# EAGLE design SchaltplanETP2 (EAGLE 6.3)
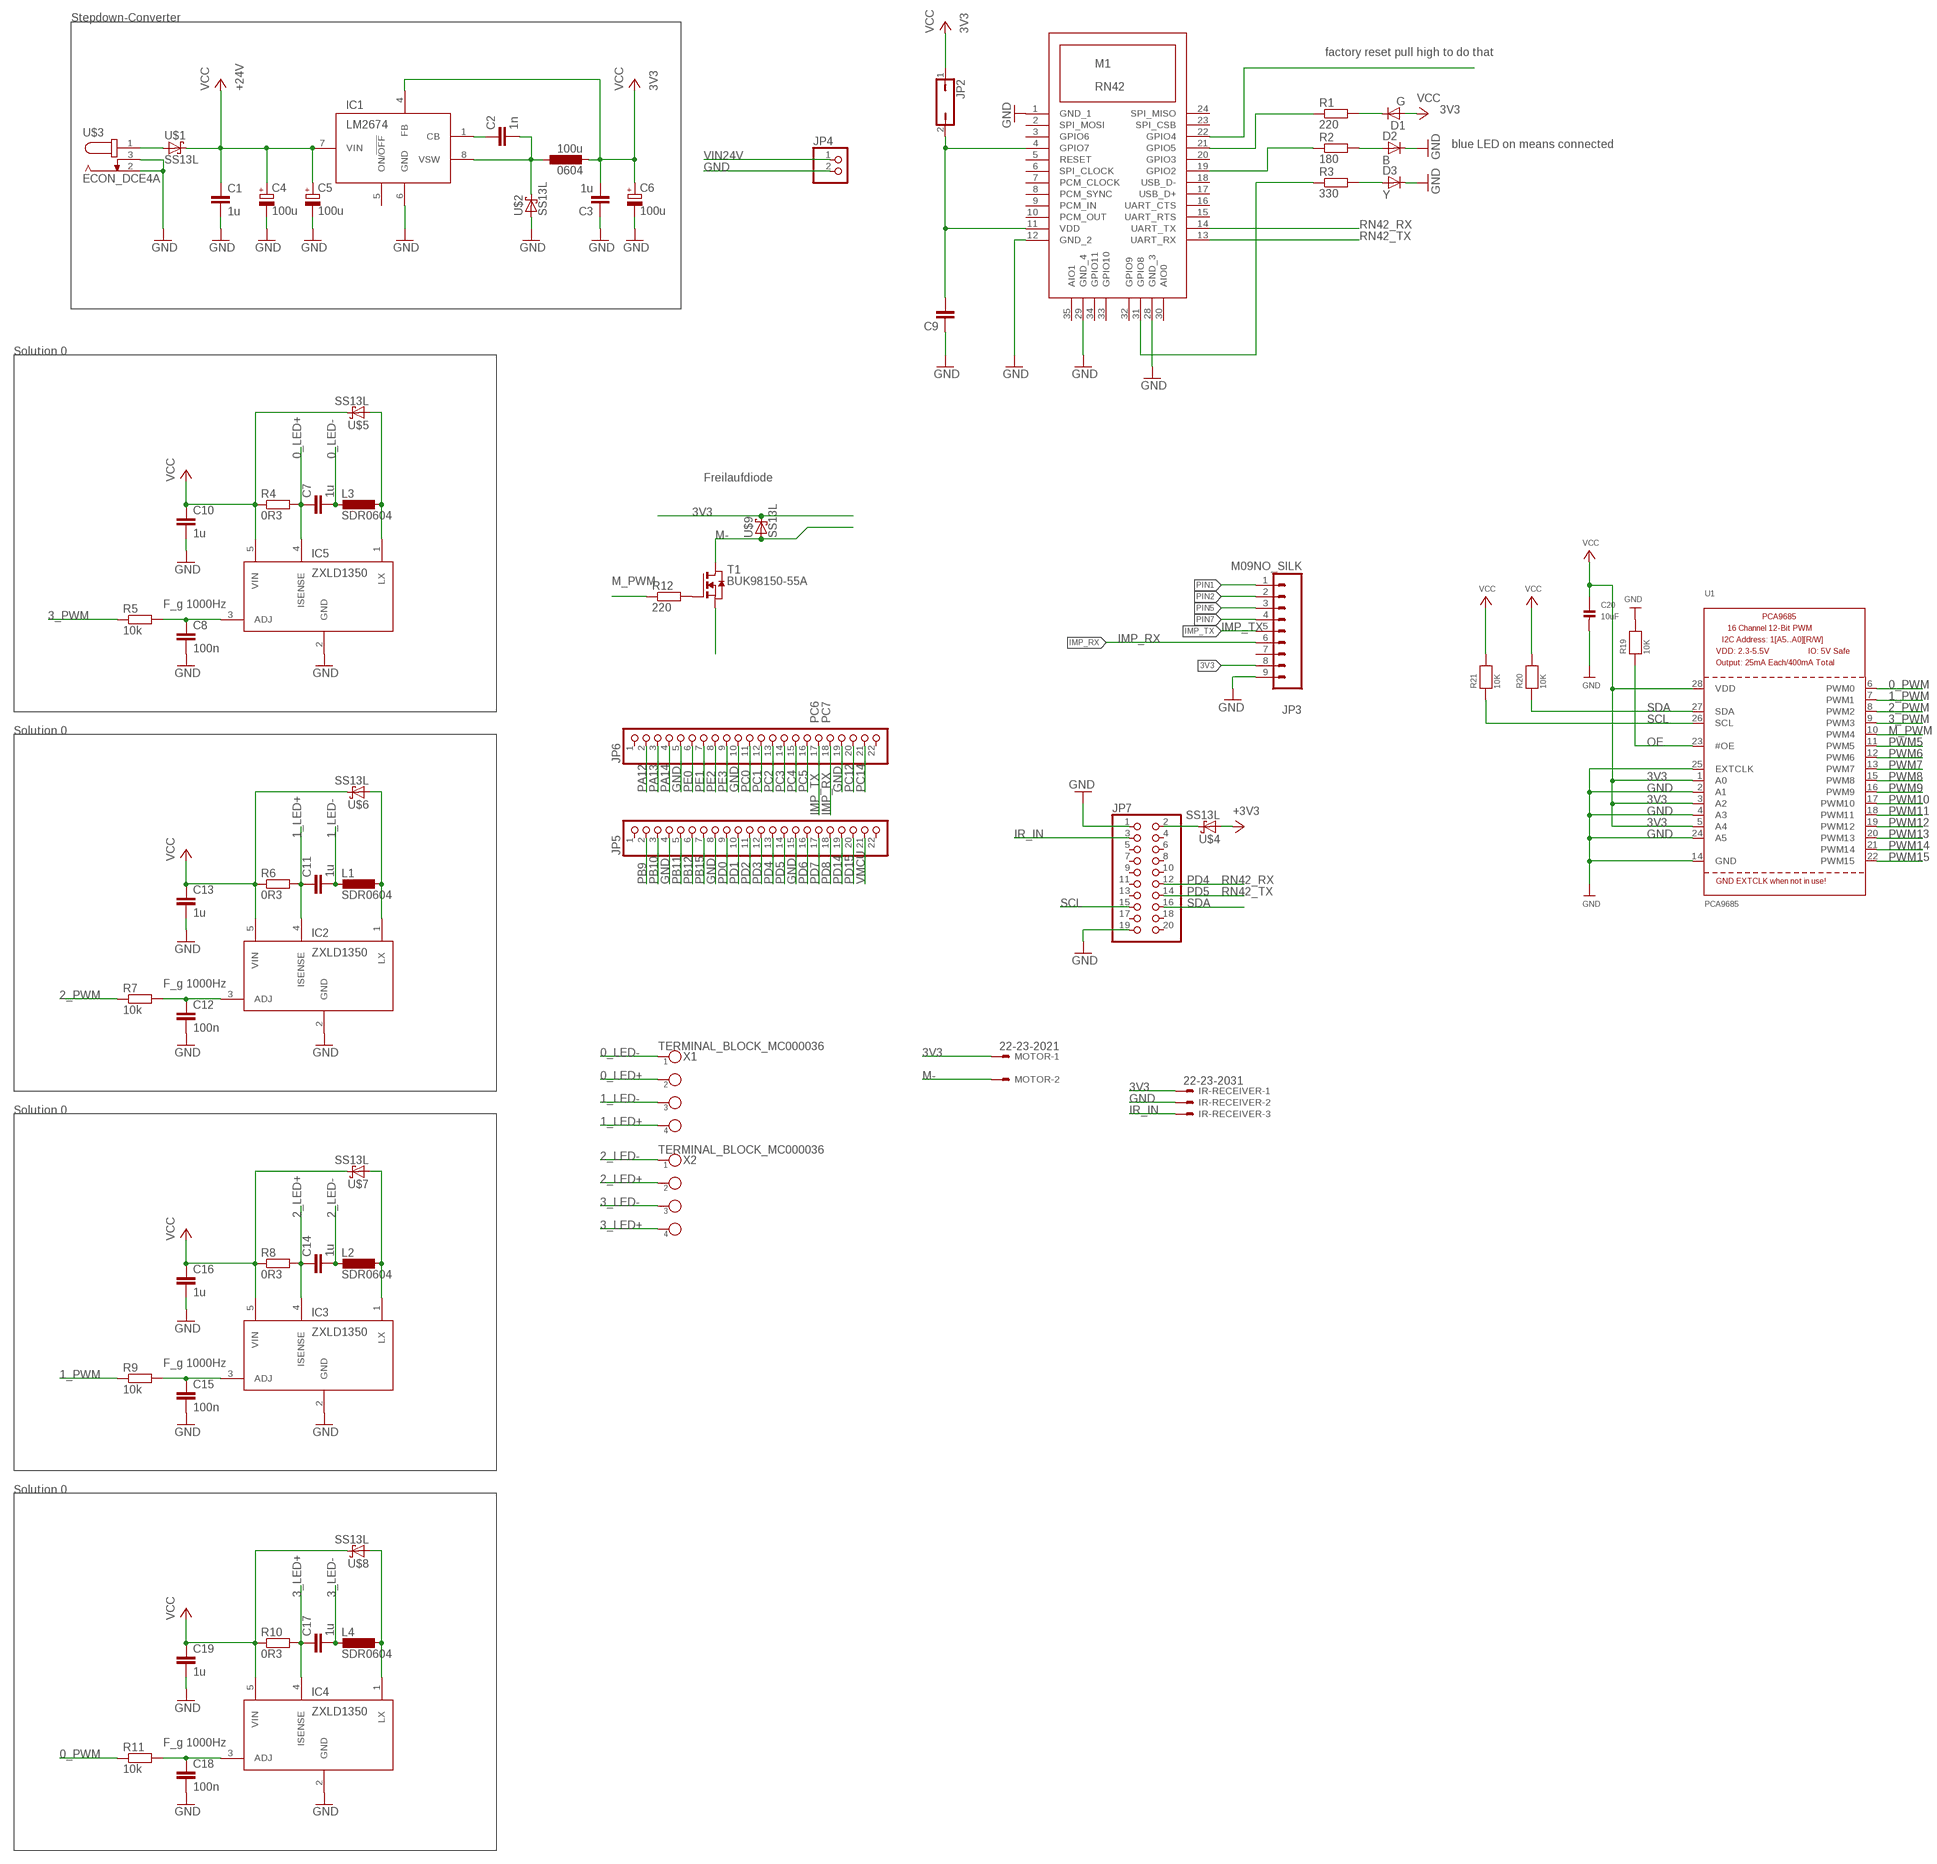
[diagram p0: schematic, sheet 1]

## Parts
0604  100u  SDR0604  [SDR0604]
C1  1u  C-EU050-025X075  [C050-025X075]
C2  1n  C-EUC0805  [C0805]
C3  1u  C-EU050-025X075  [C050-025X075]
C4  100u  CPOL-EUE2.5-7  [E2,5-7]
C5  100u  CPOL-EUE2.5-7  [E2,5-7]
C6  100u  CPOL-EUE2.5-7  [E2,5-7]
C7  1u  C-EU050-024X044  [C050-024X044]
C8  100n  C-EUC0805  [C0805]
C9  C-EUC1808  [C1808]
C10  1u  C-EU050-024X044  [C050-024X044]
C11  1u  C-EU050-024X044  [C050-024X044]
C12  100n  C-EUC0805  [C0805]
C13  1u  C-EU050-024X044  [C050-024X044]
C14  1u  C-EU050-024X044  [C050-024X044]
C15  100n  C-EUC0805  [C0805]
C16  1u  C-EU050-024X044  [C050-024X044]
C17  1u  C-EU050-024X044  [C050-024X044]
C18  100n  C-EUC0805  [C0805]
C19  1u  C-EU050-024X044  [C050-024X044]
C20  10uF  CAP_CERAMIC0805  [0805]
D1  G  TS4148RY  [D0805]
D2  B  TS4148RY  [D0805]
D3  Y  TS4148RY  [D0805]
IC1  LM2674  [SO08]
IC2  ZXLD1350  [TSOT23-5L]
IC3  ZXLD1350  [TSOT23-5L]
IC4  ZXLD1350  [TSOT23-5L]
IC5  ZXLD1350  [TSOT23-5L]
IR-RECEIVER  22-23-2031  [22-23-2031]
JP2  JP1Q  [JP1]
JP3  M09NO_SILK  [1X09_NO_SILK]
JP4  PINHD-1X2  [1X02]
JP5  PINHD-1X22  [1X22]
JP6  PINHD-1X22  [1X22]
JP7  PINHD-2X10  [2X10]
L1  SDR0604  [SDR0604]
L2  SDR0604  [SDR0604]
L3  SDR0604  [SDR0604]
L4  SDR0604  [SDR0604]
M1  RN42_BLUETOOTH  [RN42_BLUETOOTH]
MOTOR  22-23-2021  [22-23-2021]
R1  220  R-EU_R0603  [R0603]
R2  180  R-EU_R0603  [R0603]
R3  330  R-EU_R0603  [R0603]
R4  0R3  R-EU_M0805  [M0805]
R5  10k  R-EU_M0805  [M0805]
R6  0R3  R-EU_M0805  [M0805]
R7  10k  R-EU_M0805  [M0805]
R8  0R3  R-EU_M0805  [M0805]
R9  10k  R-EU_M0805  [M0805]
R10  0R3  R-EU_M0805  [M0805]
R11  10k  R-EU_M0805  [M0805]
R12  220  R-EU_M0805  [M0805]
R19  10K  RESISTOR0805  [0805]
R20  10K  RESISTOR0805  [0805]
R21  10K  RESISTOR0805  [0805]
T1  BUK98150-55A  [SOT223]
U1  PCA9685  [TSSOP28]
U$1  SS13L  [SUB-SMA]
U$2  SS13L  [SUB-SMA]
U$3  ECON_DCE4A  DC_JACK_ECON_DCE4A  [DC_JACK_ECON_DCE4A]
U$4  SS13L  [SUB-SMA]
U$5  SS13L  [SUB-SMA]
U$6  SS13L  [SUB-SMA]
U$7  SS13L  [SUB-SMA]
U$8  SS13L  [SUB-SMA]
U$9  SS13L  [SUB-SMA]
X1  TERMINAL_BLOCK_MC000036  [TERMINAL_BLOCK_MC000036]
X2  TERMINAL_BLOCK_MC000036  [TERMINAL_BLOCK_MC000036]

## Nets
0_LED+: C7.1 IC5.4(ISENSE) R4.2 X1.2
0_LED-: C7.2 L3.2 X1.1
0_PWM: R11.1 U1.6(PWM0)
1_LED+: C11.1 IC2.4(ISENSE) R6.2 X1.4
1_LED-: C11.2 L1.2 X1.3
1_PWM: R9.1 U1.7(PWM1)
2_LED+: C14.1 IC3.4(ISENSE) R8.2 X2.2
2_LED-: C14.2 L2.2 X2.1
2_PWM: R7.1 U1.8(PWM2)
3_LED+: C17.1 IC4.4(ISENSE) R10.2 X2.4
3_LED-: C17.2 L4.2 X2.3
3_PWM: R5.1 U1.9(PWM3)
3V3: 0604.2 C3.2 C6.+ C20.1 D1.A IC1.4(FB) IR-RECEIVER.1 JP2.1 JP3.8 MOTOR.1 R20.2 R21.2 U1.1(A0) U1.3(A2) U1.5(A4) U1.28(VDD) U$4.A U$9.C ; supply symbol labelled VCC, +3V3
+24V: C1.1 C4.+ C5.+ C10.1 C13.1 C16.1 C19.1 IC1.7(VIN) IC2.5(VIN) IC3.5(VIN) IC4.5(VIN) IC5.5(VIN) R4.1 R6.1 R8.1 R10.1 U$1.C U$5.C U$6.C U$7.C U$8.C ; supply symbol labelled VCC
GND: C1.2 C3.1 C4.- C5.- C6.- C8.2 C9.1 C10.2 C12.2 C13.2 C15.2 C16.2 C18.2 C19.2 C20.2 D2.C D3.C IC1.6(GND) IC2.2(GND) IC3.2(GND) IC4.2(GND) IC5.2(GND) IR-RECEIVER.2 JP3.9 JP4.2 JP5.4 JP5.8 JP7.1 JP7.19 M1.1(GND_1) M1.12(GND_2) M1.28(GND_3) M1.29(GND_4) R19.2 U1.2(A1) U1.4(A3) U1.14(GND) U1.24(A5) U1.25(EXTCLK) U$2.A U$3.2 U$3.3
IMP_RX: JP3.6 JP6.18
IMP_TX: JP3.5 JP6.17
IR_IN: IR-RECEIVER.3 JP7.3
M-: MOTOR.2 T1.2(D) T1.4(D) U$9.A
M_PWM: R12.1 U1.10(PWM4)
N$1: R12.2 T1.1(G)
N$2: C2.1 IC1.1(CB)
N$3: 0604.1 C2.2 IC1.8(VSW) U$2.C
N$4: JP7.2 U$4.C
N$5: C9.2 JP2.2 M1.4(GPIO7) M1.11(VDD)
N$6: IC5.1(LX) L3.1 U$5.A
N$7: D1.C R1.2
N$8: D2.A R2.2
N$9: D3.A R3.2
N$10: M1.21(GPIO5) R1.1
N$11: M1.19(GPIO2) R2.1
N$12: M1.31(GPIO8) R3.1
N$13: C8.1 IC5.3(ADJ) R5.2
N$14: IC2.1(LX) L1.1 U$6.A
N$15: C12.1 IC2.3(ADJ) R7.2
N$16: IC3.1(LX) L2.1 U$7.A
N$17: C15.1 IC3.3(ADJ) R9.2
N$18: IC4.1(LX) L4.1 U$8.A
N$19: C18.1 IC4.3(ADJ) R11.2
N$20: T1.3(S)
N$21: M1.22(GPIO4)
OE: R19.1 U1.23(#OE)
PA12: JP6.2
PA13: JP6.3
PB9: JP5.2
PB10: JP5.3
PB11: JP5.5
PB12: JP5.6
PB15: JP5.7
PIN1: JP3.1
PIN2: JP3.2
PIN5: JP3.3
PIN7: JP3.4
PWM5: U1.11(PWM5)
PWM6: U1.12(PWM6)
PWM7: U1.13(PWM7)
PWM8: U1.15(PWM8)
PWM9: U1.16(PWM9)
PWM10: U1.17(PWM10)
PWM11: U1.18(PWM11)
PWM12: U1.19(PWM12)
PWM13: U1.20(PWM13)
PWM14: U1.21(PWM14)
PWM15: U1.22(PWM15)
RN42_RX: JP7.12 M1.14(UART_TX)
RN42_TX: JP7.14 M1.13(UART_RX)
SCL: JP7.15 R21.1 U1.26(SCL)
SDA: JP7.16 R20.1 U1.27(SDA)
VIN24V: JP4.1 U$1.A U$3.1
Unconnected: IC1.5(ON/!OFF) JP3.7 JP5.1 JP5.9 JP5.10 JP5.11 JP5.12 JP5.13 JP5.14 JP5.15 JP5.16 JP5.17 JP5.18 JP5.19 JP5.20 JP5.21 JP5.22 JP6.1 JP6.4 JP6.5 JP6.6 JP6.7 JP6.8 JP6.9 JP6.10 JP6.11 JP6.12 JP6.13 JP6.14 JP6.15 JP6.16 JP6.19 JP6.20 JP6.21 JP6.22 JP7.4 JP7.5 JP7.6 JP7.7 JP7.8 JP7.9 JP7.10 JP7.11 JP7.13 JP7.17 JP7.18 JP7.20 M1.2(SPI_MOSI) M1.3(GPIO6) M1.5(RESET) M1.6(SPI_CLOCK) M1.7(PCM_CLOCK) M1.8(PCM_SYNC) M1.9(PCM_IN) M1.10(PCM_OUT) M1.15(UART_RTS) M1.16(UART_CTS) M1.17(USB_D+) M1.18(USB_D-) M1.20(GPIO3) M1.23(SPI_CSB) M1.24(SPI_MISO) M1.30(AIO0) M1.32(GPIO9) M1.33(GPIO10) M1.34(GPIO11) M1.35(AIO1)

## Notes on the sheet
- Stepdown-Converter
- factory reset pull high to do that
- blue LED on means connected
- Solution 0
- Freilaufdiode
- F_g 1000Hz
- PC6 | PC7
- Solution 0
- PD4
- PD5
- F_g 1000Hz
- Solution 0
- F_g 1000Hz
- Solution 0
- F_g 1000Hz

## Library data of the parts
0604 L1-L4 = Moodlight:SDR0604: SDR0604
C1-C3 C7-C19 = rcl:C-EU: CAPACITOR, European symbol
C4-C6 = rcl:CPOL-EU: POLARIZED CAPACITOR, European symbol
C20 = microbuilder:CAP_CERAMIC: Ceramic Capacitors 0402 - 0402 Surface Mount Capacitors 16pF 50V 5% [Digikey: 445-4899-2-ND] 18pF 50V 5% [Digikey: 490-1281-2-ND] 22pF 50V 5% [Digikey: 490-1283-2-ND] 68pF 50V 5% [Digikey: 490-1289-2-ND] 0.1uF 10V 10% [Digikey: 490-1318-2-ND] 1.0uF 6.3V 10% [Digikey: 490-1320-2-ND] 0603 - 0603 Surface Mount Capacitors 16 pF 50V 5% [Digikey: 445-5051-2-ND] 22 pF 50V [Digikey: PCC220ACVTR-ND] 33 pF 50V 5% [Digikey: 490-1415-1-ND] 56pF 50V 5% [Digikey: 490-1421-1-ND] 220pF 50V 5% [Digikey: 445-1285-1-ND] 680 pF 50V 2200 pF 50V 5% C0G [Digikey: 445-1297-1-ND] 5600 pF 100V 5% X7R [Digikey: 478-3711-1-ND] 0.1 µF 25V 10% [Digikey: PCC2277TR-ND] 0.22 µF 16V 10% X7R [Digikey: 445-1318-1-ND] 1.0 µF 25V 10% [Digikey: 445-5146-2-ND] 0603 - RF Specific 3pF 250V +/-0.1pF RF [Digikey: 712-1347-1-ND] 18 pF 250V 5% [Digikey: 478-3505-1-ND or 712-1322-1-ND] 56 pF 250V 5% C0G RF [Digikey: 490-4867-1-ND] 68 pF 250V RF [Digikey: 490-4868-1-ND] 0805 - 0805 Surface Mount Capacitors 220 pF 250V 2% RF Ceramic Capacitor [Digikey: 712-1398-1-ND] 1000 pF 50V 2% NP0 Ceramic Capacitor [Digikey: 478-3760-1-ND] 0.1 µF 25V 10% Ceramic Capacitor [Digikey: PCC1828TR-ND] 1.0 µF 16V 10% Ceramic Capacitor[Digikey: 490-1691-2-ND] 10.0 µF 10V 10% Ceramic Capacitor[Digikey: 709-1228-1-ND] 10.0 uF 16V 10% Ceramic Capacitor [Digikey: 478-5165-2-ND] 47 uF 6.3V 20% Ceramic Capacitor [Digikey: 587-1779-1-ND or 399-5506-1-ND] 1206 - 1206 Surface Mount Capacitors 47uF 10V 20% Ceramic Capacitor [Digikey: 490-5528-1-ND or 399-5508-1-ND or 445-6010-1-ND] 100uF 6.3V -20%, +80% Y5V Ceramic Capacitor (Digikey: 490-4512-1-ND, Mouser: 81-GRM31CF50J107ZE1L)
D1-D3 = Moodlight:TS4148RY: Small Signal Diode
IC1 = Moodlight:LM2674: LM2674 High Efficiency 500 mA Step-Down Voltage Regulator
IC2-IC5 = Moodlight:ZXLD1350: ZXLD1350 30V 350mA LED DRIVER with AEC-Q100
IR-RECEIVER = con-molex:22-23-2031: .100" (2.54mm) Center Header - 3 Pin; MF: MOLEX; MPN: 22-23-2031; OC_FARNELL: 1462950; OC_NEWARK: 30C0862
JP2 = jumper:JP1Q: JUMPER
JP3 = SparkFun-Connectors:M09: Header 9 Standard 9-pin 0.1" header. Use with straight break away headers (SKU : PRT-00116), right angle break away headers (PRT-00553), swiss pins (PRT-00743), machine pins (PRT-00117), and female headers (PRT-00115).
JP4 = pinhead:PINHD-1X2: PIN HEADER
JP5 JP6 = pinhead:PINHD-1X22: PIN HEADER
JP7 = pinhead:PINHD-2X10: PIN HEADER
M1 = Moodlight:RN42_BLUETOOTH: RN42 Bluetooth module
MOTOR = con-molex:22-23-2021: .100" (2.54mm) Center Header - 2 Pin; MF: MOLEX; MPN: 22-23-2021; OC_FARNELL: 1462926; OC_NEWARK: 25C3832
R1-R12 = rcl:R-EU_: RESISTOR, European symbol
R19-R21 = microbuilder:RESISTOR: Resistors 0402 - 0402 Surface Mount Package 22 Ohm 1% 1/16W [Digikey: 311-22.0LRTR-ND] 33 Ohm 5% 1/16W 1.0K 5% 1/16W 1.5K 5% 1/16W 2.0K 1% 1/16W 10.0K 1% 1/16W [Digikey: 311-10.0KLRTR-ND] 10.0K 5% 1/16W [Digikey: RMCF0402JT10K0TR-ND] 12.1K 1% 1/16W [Digikey: 311-22.0LRTR-ND] 100.0K 5% 1/16W 0603 - 0603 Surface Mount Package 0 Ohm 1/10 Watt 1% Resistor 15 Ohm 1/10 Watt 1% Resistor 33 Ohm 1/10 Watt 1% Resistor 49.9 Ohm 1/10 Watt 1% Resistor 100 Ohm 1/10 Watt 1% Resistor 150 Ohm 1/10 Watt 1% Resistor 240 Ohm 1/10 Watt 1% Resistor 390 Ohm 1/10 Watt 1% Resistor 560 Ohm 1/10 Watt 1% Resistor 680 Ohm 1/10 Watt 1% Resistor 750 Ohm 1/10 Watt 1% Resistor 1.0K Ohm 1/10 Watt 1% Resistor 1.5K Ohm 1/10 Watt 1% Resistor 2.0K Ohm 1/10 Watt 1% Resistor 2.2K Ohm 1/10 Watt 1% Resistor 3.3K Ohm 1/10 Watt 1% Resistor 4.7K Ohm 1/10 Watt 1% Resistor 10.0K Ohm 1/10 Watt 1% Resistor 12.0K Ohm 1/10 Watt 1% Resistor 12.1K Ohm 1/10 Watt 1% Resistor 20.0K Ohm 1/10 Watt 1% Resistor 33.0K Ohm 1/10 Watt 1% Resistor 100.0K Ohm 1/10 Watt 1% Resistor 0805 - 0805 Surface Mount Package 0 Ohm 1/8 Watt 1% Resistor 33 Ohm 1/8 Watt 1% Resistor 100 Ohm 1/8 Watt 1% Resistor 150 Ohm 1/8 Watt 1% Resistor 200 Ohm 1/8 Watt 1% Resistor 240 Ohm 1/8 Watt 1% Resistor 330 Ohm 1/8 Watt 1% Resistor 390 Ohm 1/8 Watt 1% Resistor 470 Ohm 1/8 Watt 1% Resistor 1.0K Ohm 1/8 Watt 1% Resistor 1.5K Ohm 1/8 Watt 1% Resistor 2.0K Ohm 1/8 Watt 1% Resistor 4.7K Ohm 1/8 Watt 1% Resistor 5.1K Ohm 1/8 Watt 1% Resistor 5.6K Ohm 1/8 Watt 1% Resistor 10.0K Ohm 1/8 Watt 1% Resistor 22.0K Ohm 1/8 Watt 1% Resistor 33.0K Ohm 1/8 Watt 1% Resistor 100K Ohm 1/8 Watt 1% Resistor 1206 - 1206 Surface Mount Package 2012 - 2010 Surface Mount Package 0.11 Ohm 1/2 Watt 1% Resistor - Digikey: RHM.11UCT-ND
T1 = Moodlight:BUK98150-55A: n-Kanal-MOS-FET; OC_FARNELL: unknown; OC_NEWARK: unknown
U1 = microbuilder:PCA9685: PCA9685 - 16 Channel 12-Bit I2C PWM Controller 5.0V tolerant 16 channel, 12-bit I2C PWM controller with 25mA per output (max. 400mA total) Digikey: 568-5931-1-ND
U$1 U$2 U$4-U$9 = Moodlight:SS13L: Schottky-Diode 1A/30V
U$3 = Moodlight:DC_JACK_ECON_DCE4A: DC_JACK_ECON_DCE4A
X1 X2 = Moodlight:TERMINAL_BLOCK_MC000036: Terminal Block MC000036

## Board
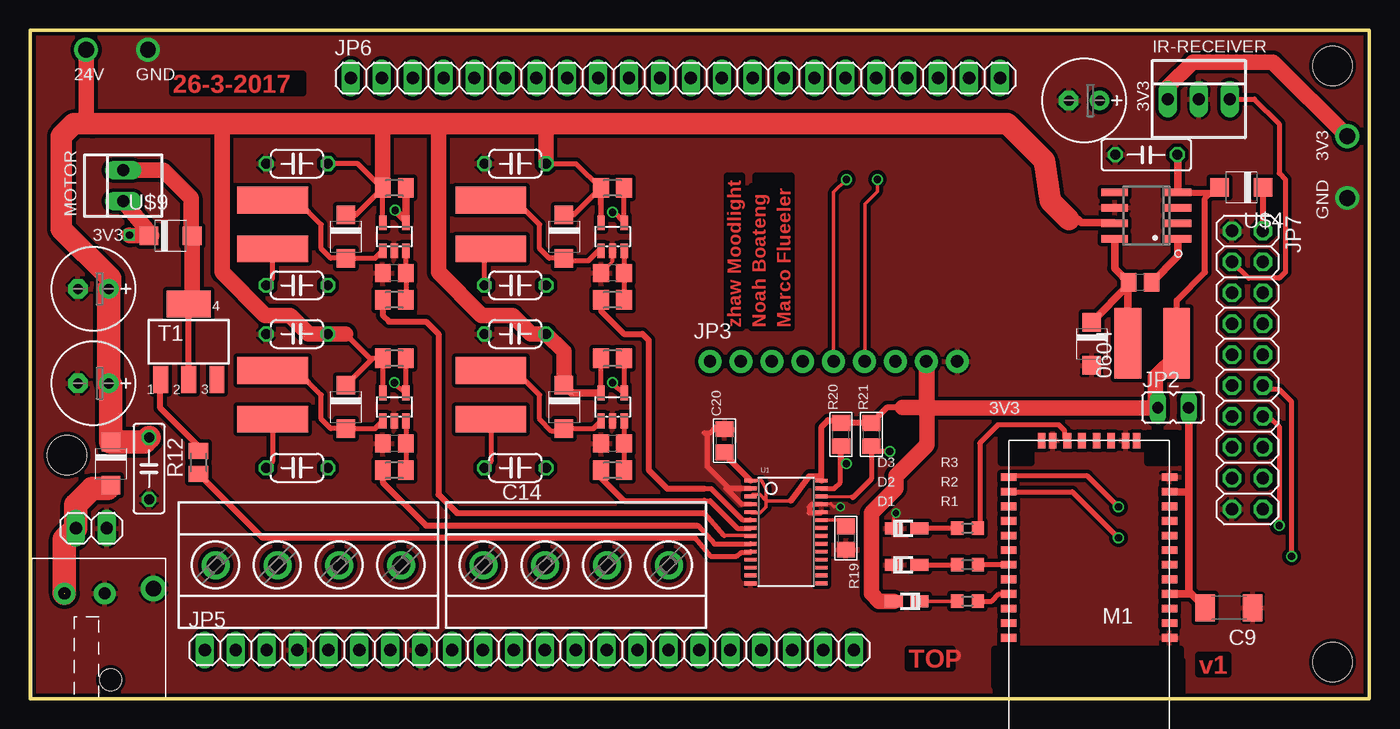
[diagram p1: board, top side]
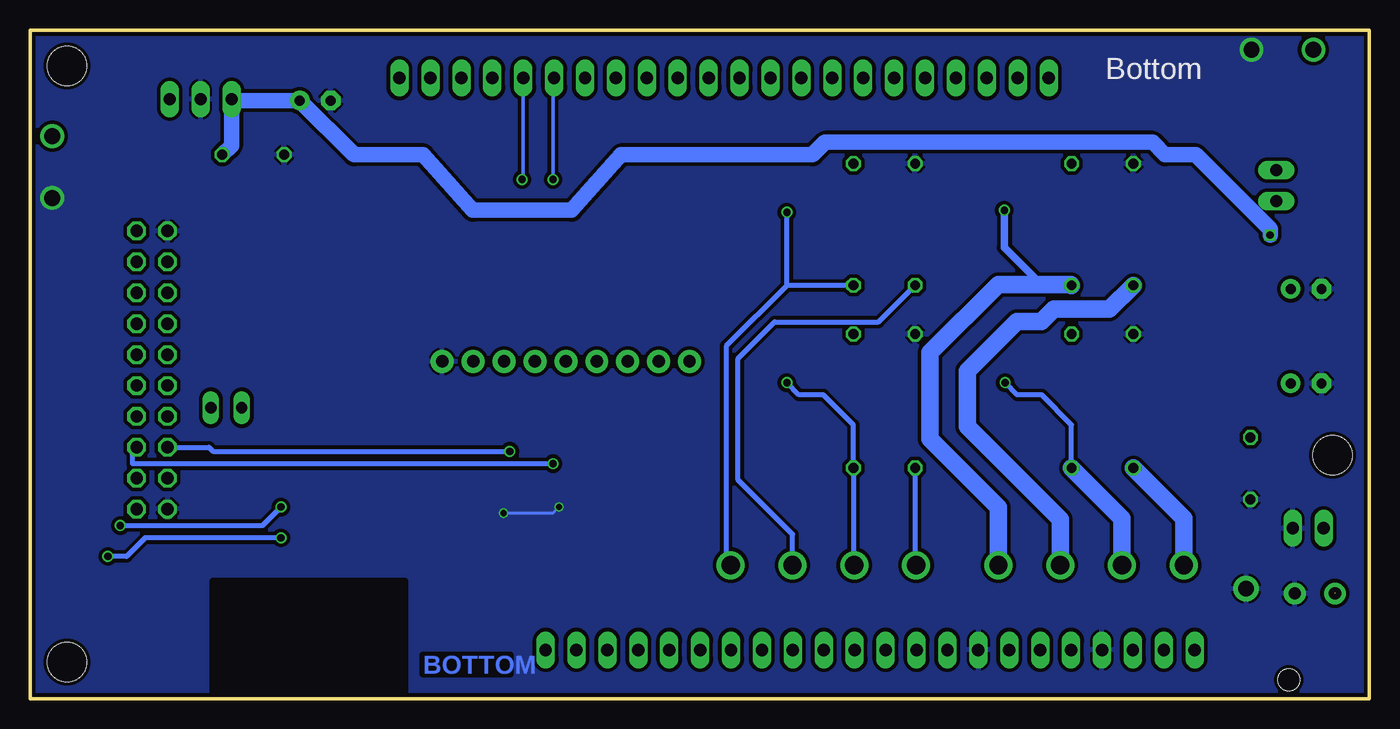
[diagram p2: board, bottom side, seen from below]

Size 110 x 54.92 mm. Coordinates in mm from the lower left corner, seen from the top.
Outline: 0,0 110,0 110,54.92 0,54.92 0,0
Copper layers (1*16): Top 0.018mm / dielectric 1.55mm / Bottom 0.018mm
Design rules "eC_2Layer_PClass6_BaseCopperO18_eCDefault": minimum track width 0.15mm, minimum drill 0.35mm, track to track 0.15mm, track to pad 0.15mm, pad to pad 0.15mm, via to via 0.15mm, smd to smd 0mil, copper to edge 0.25mm, drill to drill 0.35mm, minimum pad ring 0.175mm, minimum via ring 0.125mm, stop-mask expansion 0mil, vias tented up to drill 0.45mm, thermal gap 0.2mm
Holes 3.2 mm at 3,20 107,3 107,52
tRestrict: area 79.2,1 to 94.5,4.1
bRestrict: area 79.2,-0.5 to 95,9.7

### Footprints (pad centres in the part's own frame; a part is rotated, then mirrored left to right if it is on the bottom)
SDR0604 = smd 5.8 x 2.2: 1 0,2; 2 0,-2
C050-025X075 = drill 0.813 octagon: 1 -2.54,0; 2 2.54,0
C0805 = smd 1.3 x 1.5: 1 -0.95,0; 2 0.95,0
E2,5-7 = drill 0.813 pad 1.6: + -1.27,0 | drill 0.813 pad 1.6 octagon: - 1.27,0
C050-024X044 = drill 0.813 octagon: 1 -2.54,0; 2 2.54,0
C1808 = smd 1.6 x 2.2: 1 -1.95,0; 2 1.95,0
0805 = smd 1.3 x 1.5: 1 -0.95,0; 2 0.95,0
D0805 = smd 1.5 x 1: A 1.052,0; C -1.052,0
SO08 = smd 0.6 x 2.2: 1 -1.905,-2.6; 2 -0.635,-2.6; 3 0.635,-2.6; 4 1.905,-2.6; 5 1.905,2.6; 6 0.635,2.6; 7 -0.635,2.6; 8 -1.905,2.6
TSOT23-5L = smd 0.6 x 1.2: 1 -0.95,-1.15; 2 0,-1.15; 3 0.95,-1.15; 4 0.95,1.15; 5 -0.95,1.15
22-23-2031 = drill 1 long: 1 -2.54,0; 2 0,0; 3 2.54,0
JP1 = drill 0.914 long: 1 0,-1.27; 2 0,1.27
1X09_NO_SILK = drill 1.016 pad 1.88: 1 0,0; 2 2.54,0; 3 5.08,0; 4 7.62,0; 5 10.16,0; 6 12.7,0; 7 15.24,0; 8 17.78,0; 9 20.32,0
1X02 = drill 1.016 long: 1 -1.27,0; 2 1.27,0
1X22 = drill 1.016 long: 1 -26.67,0; 2 -24.13,0; 3 -21.59,0; 4 -19.05,0; 5 -16.51,0; 6 -13.97,0; 7 -11.43,0; 8 -8.89,0; 9 -6.35,0; 10 -3.81,0; 11 -1.27,0; 12 1.27,0; 13 3.81,0; 14 6.35,0; 15 8.89,0; 16 11.43,0; 17 13.97,0; 18 16.51,0; 19 19.05,0; 20 21.59,0; 21 24.13,0; 22 26.67,0
2X10 = drill 1.016 octagon: 1 -11.43,-1.27; 2 -11.43,1.27; 3 -8.89,-1.27; 4 -8.89,1.27; 5 -6.35,-1.27; 6 -6.35,1.27; 7 -3.81,-1.27; 8 -3.81,1.27; 9 -1.27,-1.27; 10 -1.27,1.27; 11 1.27,-1.27; 12 1.27,1.27; 13 3.81,-1.27; 14 3.81,1.27; 15 6.35,-1.27; 16 6.35,1.27; 17 8.89,-1.27; 18 8.89,1.27; 19 11.43,-1.27; 20 11.43,1.27
RN42_BLUETOOTH = smd 1.27 x 0.635: 1 -6.6,0; 2 -6.6,-1.2; 3 -6.6,-2.4; 4 -6.6,-3.6; 5 -6.6,-4.8; 6 -6.6,-6; 7 -6.6,-7.2; 8 -6.6,-8.4; 9 -6.6,-9.6; 10 -6.6,-10.8; 11 -6.6,-12; 12 -6.6,-13.2; 13 6.6,-13.2; 14 6.6,-12; 15 6.6,-10.8; 16 6.6,-9.6; 17 6.6,-8.4; 18 6.6,-7.2; 19 6.6,-6; 20 6.6,-4.8; 21 6.6,-3.6; 22 6.6,-2.4; 23 6.6,-1.2; 24 6.6,0 | smd 0.635 x 1.27: 28 3,-16.2; 29 -3,-16.2; 30 3.9,-16.2; 31 1.8,-16.2; 32 0.6,-16.2; 33 -0.6,-16.2; 34 -1.8,-16.2; 35 -3.9,-16.2
22-23-2021 = drill 1 long: 1 -1.27,0; 2 1.27,0
R0603 = smd 1 x 1.1: 1 -0.85,0; 2 0.85,0
M0805 = smd 1.3 x 1.6: 1 -0.95,0; 2 0.95,0
SOT223 = smd 1.219 x 2.235: 1 -2.311,-3.099; 2 0,-3.099; 3 2.311,-3.099 | smd 3.6 x 2.2: 4 0,3.099
TSSOP28 = smd 0.305 x 0.991: 1 -4.225,-2.918; 2 -3.575,-2.918; 3 -2.925,-2.918; 4 -2.275,-2.918; 5 -1.625,-2.918; 6 -0.975,-2.918; 7 -0.325,-2.918; 8 0.325,-2.918; 9 0.975,-2.918; 10 1.625,-2.918; 11 2.275,-2.918; 12 2.925,-2.918; 13 3.575,-2.918; 14 4.225,-2.918; 15 4.225,2.918; 16 3.575,2.918; 17 2.925,2.918; 18 2.275,2.918; 19 1.625,2.918; 20 0.975,2.918; 21 0.325,2.918; 22 -0.325,2.918; 23 -0.975,2.918; 24 -1.625,2.918; 25 -2.275,2.918; 26 -2.925,2.918; 27 -3.575,2.918; 28 -4.225,2.918
SUB-SMA = smd 1.524 x 1.524: A 1.778,0; C -1.778,0
DC_JACK_ECON_DCE4A = drill 1 pad 1.778: 1 0,3.8; 3 0,0.5 | drill 1.3 pad 2.1: 2 0.4,-3.5 | hole 1.8: -7.1,0
TERMINAL_BLOCK_MC000036 = drill 1.501 pad 2.3: 1 -7.62,0; 2 -2.54,0; 3 2.54,0; 4 7.62,0

### Placement (x,y rotation side)
0604  92.18,29.21 90 top
C1  9.74,18.91 270 top
C2  91.18,34.21 180 top
C3  91.69,44.7 0 top
C4  5.18,25.91 180 top
C5  5.18,33.68 180 top
C6  86.6,49.16 180 top
C7  21.9,18.97 180 top
C8  29.9,20.97 180 top
C9  98.49,7.46 180 top
C10  21.9,29.97 180 top
C11  21.9,33.97 180 top
C12  29.9,34.97 180 top
C13  21.9,43.97 180 top
C14  39.84,18.97 180 top
C15  47.84,20.97 180 top
C16  39.84,29.97 180 top
C17  39.84,33.97 180 top
C18  47.84,34.97 180 top
C19  39.84,43.97 180 top
C20  57.03,21.19 90 top
D1  72,8 180 top
D2  72,11 0 top
D3  72,14 0 top
IC1  91.69,39.7 90 top
IC2  29.9,37.97 0 top
IC3  47.84,23.97 0 top
IC4  47.84,37.97 0 top
IC5  29.9,23.97 0 top
IR-RECEIVER  96.01,49.28 0 top
JP2  93.9,23.9 270 top
JP3  55.84,27.71 0 top
JP4  5,14 0 top
JP5  41,4 0 top
JP6  53,51 0 top
JP7  100,27 270 top
L1  19.9,38.97 0 top
L2  37.84,24.97 0 top
L3  19.9,24.97 0 top
L4  37.84,38.97 0 top
M1  87,5 180 top
MOTOR  7.62,42.16 90 top
R1  77,8 180 top
R2  77,11 180 top
R3  77,14 180 top
R4  29.9,27.97 0 top
R5  29.9,18.77 0 top
R6  29.9,41.97 0 top
R7  29.9,32.77 0 top
R8  47.84,27.97 0 top
R9  47.84,18.77 0 top
R10  47.84,41.97 0 top
R11  47.84,32.77 0 top
R12  13.82,19.42 90 top
R19  67.02,13.19 270 top
R20  66.62,21.7 90 top
R21  69.11,21.7 90 top
T1  13.01,29.32 0 top
U1  62.09,13.7 270 top
U$1  6.6,19.3 270 top
U$2  87.2,29.16 270 top
U$3  6.6,8.64 90 top
U$4  99.51,42 180 top
U$5  25.9,23.97 270 top
U$6  25.9,37.97 270 top
U$7  43.84,23.97 270 top
U$8  43.84,37.97 270 top
U$9  11.52,38.05 0 top
X1  22.84,10.97 0 top
X2  44.84,10.97 0 top

### Tracks (layer width: path | path; a pad name or v marks a point on that pad's centre or on a via)
0_LED+  (via drill 0.6)
  Top 0.406: R4.2 IC5.4 29.7,25.97 v29.9,25.97
  Bottom 0.406: C7.1 24.44,22.51 26.9,24.97 28.9,24.97 v29.9,25.97
  Bottom 1.422: X1.2 20.3,14.82 C7.1
0_LED-
  Top 0.406: L3.2 19.9,19.51 C7.2
  Bottom 1.422: X1.1 15.22,14.82 C7.2
0_PWM
  Top 0.406: 55.37,17.27 55.93,17.27 58.5,14.7 59.15,14.7 U1.6
  Top 0.508: R11.1 46.89,31.85 48.77,29.97 50.29,29.97 50.8,29.46 50.8,18.8 52.32,17.27 55.37,17.27
1_LED+  (via drill 0.6)
  Top 0.61: R6.2 IC2.4 30.85,39.25 v29.97,40.13
  Bottom 0.61: v29.97,40.13 29.97,37.08 26.92,34.04
  Bottom 1.422: X1.4 30.46,15.73 36.07,21.34 36.07,28.45 30.48,34.04 26.92,34.04 24.51,34.04 C11.1
1_LED-
  Top 0.406: C11.2 19.9,34.51 L1.2
  Bottom 1.422: X1.3 25.38,14.71 33.02,22.35 33.02,26.92 28.96,30.99 26.92,30.99 25.91,32 21.33,32 C11.2
1_PWM
  Top 0.406: 55.37,16.26 55.84,16.26 58.1,14 59.15,14 U1.7
  Top 0.508: R9.1 46.89,18.13 48.77,16.26 55.37,16.26
2_LED+  (via drill 0.6)
  Top 0.406: R8.2 IC3.4 47.64,25.97 v47.84,25.97
  Bottom 0.406: X2.2 42.38,11.05 C14.1 42.38,22.51 44.84,24.97 46.84,24.97 v47.84,25.97
2_LED-
  Top 0.406: L2.2 37.84,19.51 C14.2
  Bottom 0.406: C14.2 37.3,11.05 X2.1
2_PWM
  Top 0.305: 57.01,13.4 59.15,13.4 U1.8
  Top 0.406: 57.01,13.4 55.37,15.24
  Top 0.508: R7.1 28.95,31.5 29.46,30.99 32.51,30.99 33.53,29.97 33.53,16.76 35.05,15.24 55.37,15.24
3_LED+  (via drill 0.6)
  Top 0.406: R10.2 IC4.4 47.94,39.97 v47.84,39.97
  Bottom 0.406: C17.1 47.84,33.97 | 47.84,33.97 52.84,28.97 52.84,11.35 X2.4 | 47.84,33.97 v47.84,39.97
3_LED-
  Top 0.406: C17.2 37.3,36.43 L4.2
  Bottom 0.406: X2.3 47.38,13.51 51.84,17.97 51.84,27.97 48.84,30.97 40.3,30.97 C17.2
3_PWM
  Top 0.406: 54.77,14.22 54.88,14.22 56.2,12.7 59.15,12.7 U1.9
  Top 0.508: R5.1 28.95,17.78 32.51,14.22 54.77,14.22
3V3  (via drill 0.6, 1.3)
  Top 0.305: U1.1 60.09,17.92 60.45,17.27 60.45,16.26 | U1.5 59.26,15.24 59.94,15.24 60.45,15.75 60.45,16.26 | 60.45,16.26 59.94,16.76 59.32,16.76 U1.3 | 60.45,16.26 62.48,16.26
  Top 0.508: IC1.4 97.03,41.6 | 97.03,41.6 97.33,41.6 U$4.A | 0604.2 94.18,32.72 96.52,35.05 96.52,41.1 97.03,41.6 | 57.03,20.07 U1.1 | 71.67,23.92 70.38,23.92 R21.2 R20.2 66.4,22.86 65.53,22.86 65.01,22.34 U1.28 64.87,18.29 64.01,18.29 62.48,16.26
  Top 0.61: IC1.4 94.29,44.64 C3.2 | C20.1 57.03,20.07
  Top 1.27: MOTOR.1 9.95,38.05 U$9.C 8.18,38.05 v8.13,38.1 | 0604.2 94.18,28.14 92.46,26.42 92.46,24.08 JP2.1 92.6,23.88 73.66,23.88 | D1.A 69.72,8 69.09,8.64 69.09,15.24 71.12,17.27 71.12,18.29 73.66,20.83 73.66,23.88 | 73.66,23.88 73.66,27.67 JP3.8 73.62,23.92 | 73.62,23.92 73.66,23.88 | 73.62,23.92 71.67,23.92 | v108.2,46.23 102.11,52.32 95.5,52.32 93.47,50.29 IR-RECEIVER.1
  Bottom 1.27: v8.13,38.1 8.13,38.61 14.22,44.7 16.76,44.7 17.78,45.72 44.7,45.72 45.72,44.7 61.47,44.7 65.53,40.13 73.66,40.13 77.72,44.7 83.41,44.7 C6.+ 92.85,49.16 IR-RECEIVER.1 93.47,45.46 C3.2
+24V  (via drill 1.3)
  Top 0.406: 28.13,27.97 R4.1 IC5.5 | 28.13,27.97 U$5.C | 28.95,41.92 R6.1 26.73,39.75 U$6.C | IC2.5 28.95,41.92 | 28.95,41.92 26.9,43.97 C13.1 | IC3.5 R8.1 | 28.13,27.97 27.9,27.97 25.9,29.97 C10.1 | C19.1 44.84,43.97 R10.1 IC4.5 46.85,41.97 | 46.85,41.97 46.84,41.97 | U$8.C 44.63,39.75 46.85,41.97
  Top 0.61: 85.34,39.37 86.11,39.37 86.36,39.12 89.04,39.12 IC1.7 | IC3.5 44.47,25.12 U$7.C
  Top 1.27: C19.1 42.38,46.95 42.67,47.24 | 28.95,41.92 28.95,47.24 28.96,47.24 | 25.9,29.97 22.86,29.97 21.34,31.5 19.3,31.5 15.75,35.05 15.75,47.24 | U$7.C 43.84,28.51 C16.1 41.15,29.97 39.62,31.5 37.08,31.5 33.53,35.05 33.53,47.24 | v4.57,53.34 4.57,47.75 5.08,47.24
  Top 1.778: C5.+ 6.6,33.83 6.6,34.54 2.54,38.61 2.54,46.23 3.56,47.24 5.08,47.24 15.75,47.24 28.96,47.24 33.53,47.24 42.67,47.24 80.26,47.24 83.31,44.2 83.82,40.89 85.34,39.37
  Top 1.93: C5.+ C4.+ 6.6,25.75 U$1.C 9.38,21.08 C1.1
GND  (via drill 0.5, 1.3)
  Top 0.254: D3.C 70.95,15.07 v71.12,15.24 | v66.55,15.75 66.04,15.75 65.79,16 65.04,16 U1.25
  Top 0.305: IC4.2 47.84,35.92 C18.2
  Top 0.406: U1.4 58.42,15.97 58.42,16 57.15,17.27 57.4,17.27 | 57.4,17.27 U1.2 57.41,17.27 57.4,17.27 | 57.4,17.27 55.63,19.05 55.63,21.59 55.37,21.84 55.88,21.84 56.39,22.35 56.9,22.35 | U1.25 64.23,15.97 64.01,15.75 64.01,15.24 64.93,15.24 U1.24
  Bottom 0.254: v71.12,15.24 67.06,15.24 v66.55,15.75
  other vias: 9.65,53.34 108.2,41.15
  pour Bottom (isolate 0.305): 0,54.86 110.24,54.86 110.24,-0.51 0,-0.51
  pour Top (isolate 0.305): 0,54.86 110.24,54.86 110.24,0 0,0
IMP_RX  (via drill 0.6)
  Top 0.305: v69.6,42.67 69.6,41.66 68.58,40.64 68.58,27.75 JP3.6
  Bottom 0.305: JP6.18 69.51,42.76 v69.6,42.67
IMP_TX  (via drill 0.6)
  Top 0.305: JP3.5 66,41.62 v67.06,42.67
  Bottom 0.305: v67.06,42.67 67.06,50.91 JP6.17
IR_IN
  Top 0.406: IR-RECEIVER.3 100.58,49.28 102.62,47.24 102.62,43.18 103.12,42.67 103.12,35.05 102.62,34.54 100.08,34.54 JP7.3
M-
  Top 0.508: T1.2 T1.4
  Top 1.27: MOTOR.2 10.92,43.43 13.21,41.15 13.21,38.14 U$9.A 13.29,32.7 T1.4
M_PWM
  Top 0.406: 54.57,13.21 54.57,13.23 55.9,11.7 58,11.7 58.4,12 59.15,12 U1.10
  Top 0.508: 54.57,13.21 19.08,13.21 R12.1
N$1
  Top 0.508: R12.2 13.82,20.72 10.67,23.88 10.67,26.42 10.38,26.42 T1.1
N$2
  Top 0.61: IC1.1 94.29,36.37 C2.1
N$3
  Top 0.61: IC1.8 89.09,35.35 C2.2 | C2.2 90.23,33.97 U$2.C | 0604.1 90.18,34.16 C2.2
N$4
  Top 0.508: U$4.C 101.29,38.41 | 101.29,38.41 101.6,38.1 | 101.29,38.41 JP7.2
N$5
  Top 0.61: M1.4 95.4,8.6 | 95.4,8.6 C9.2 | JP2.2 95.17,16.76 | 95.17,16.76 95.17,8.83 95.4,8.6 | M1.11 94.93,17 95.17,16.76
N$6
  Top 0.406: IC5.1 28.33,22.19 U$5.A 24.68,22.19 23.9,22.97 23.9,24.97 21.9,26.97 L3.1
N$7
  Top 0.305: R1.2 D1.C
N$8
  Top 0.406: D2.A R2.2
N$9
  Top 0.406: R3.2 D3.A
N$10
  Top 0.406: R1.1 79,8 79.6,8.6 M1.21
N$11
  Top 0.406: M1.19 R2.1
N$12
  Top 0.406: M1.31 85,21.4 85,22 84.51,22.5 79.49,22.5 78,21 78,14 R3.1
N$13
  Top 0.406: R5.2 C8.1 IC5.3
N$14
  Top 0.406: L1.1 21.9,40.97 23.9,38.97 23.9,36.97 24.68,36.19 U$6.A 28.33,36.19 IC2.1
N$15
  Top 0.406: R7.2 C12.1 IC2.3
N$16
  Top 0.406: L2.1 39.84,26.97 41.84,24.97 41.84,22.97 42.84,21.97 43.62,21.97 U$7.A 46.26,22.19 IC3.1
N$17
  Top 0.406: IC3.3 C15.1 R9.2
N$18
  Top 0.406: L4.1 39.84,40.97 41.84,38.97 41.84,36.97 42.62,36.19 U$8.A 44.06,35.97 45.84,35.97 46.69,36.82 IC4.1
N$19
  Top 0.406: IC4.3 C18.1 R11.2
OE
  Top 0.305: U1.23 67,14.67 R19.1
RN42_RX  (via drill 0.6)
  Top 0.406: M1.14 85.62,17 v89.41,13.21 | v103.63,11.68 103.63,24.38 102.62,25.4 101.6,25.4 JP7.12
  Bottom 0.406: v89.41,13.21 100.58,13.21 102.11,11.68 v103.63,11.68
RN42_TX  (via drill 0.6)
  Top 0.406: JP7.14 101.78,23.19 102.62,22.35 v102.62,14.22 | v89.41,15.75 86.87,18.29 80.49,18.29 M1.13
  Bottom 0.406: v102.62,14.22 90.93,14.22 v89.41,15.75
SCL  (via drill 0.6)
  Top 0.254: U1.26 67.45,16.62 67.56,16.51
  Top 0.406: 67.56,16.51 69.11,18.05 R21.1 69.53,20.32 v70.61,20.32
  Bottom 0.406: JP7.15 95.33,20.65 95,20.32 v70.61,20.32
SDA  (via drill 0.6)
  Top 0.406: U1.27 66.04,17.27 66.55,17.78 66.55,20.68 R20.1 66.62,19.74 v67.06,19.3
  Bottom 0.406: v67.06,19.3 101.6,19.3 101.6,20.32 JP7.16
VIN24V  (1 unrouted)
  Top 0.305: U$1.A 6.35,17.27
  Top 1.93: U$3.1 2.79,13.06 JP4.1 3.73,15.92 5.08,17.27 6.35,17.27

### Text on the board
Top: 26-3-2017 | zhaw Moodlight | Noah Boateng | Marco Flueeler | TOP | v1
Bottom: BOTTOM
tNames: 24V | GND | 3V3 | 3V3 | GND | 3V3 | ° | 3V3
bNames: Bottom